# EasyEDA Pro project ProPrj_Practice 4 layer_2025-09-09.epro, schematic Uni Analog In
Board Name: Universal Analog Input; Create Date: 2025-08-09; Page Name: P1; Project Name: Practice 4 layer; Schematic Name: Uni Analog In; Update Date: 2025-08-20; Company: EasyEDA.com; Page Size: A4; Version: V1.0
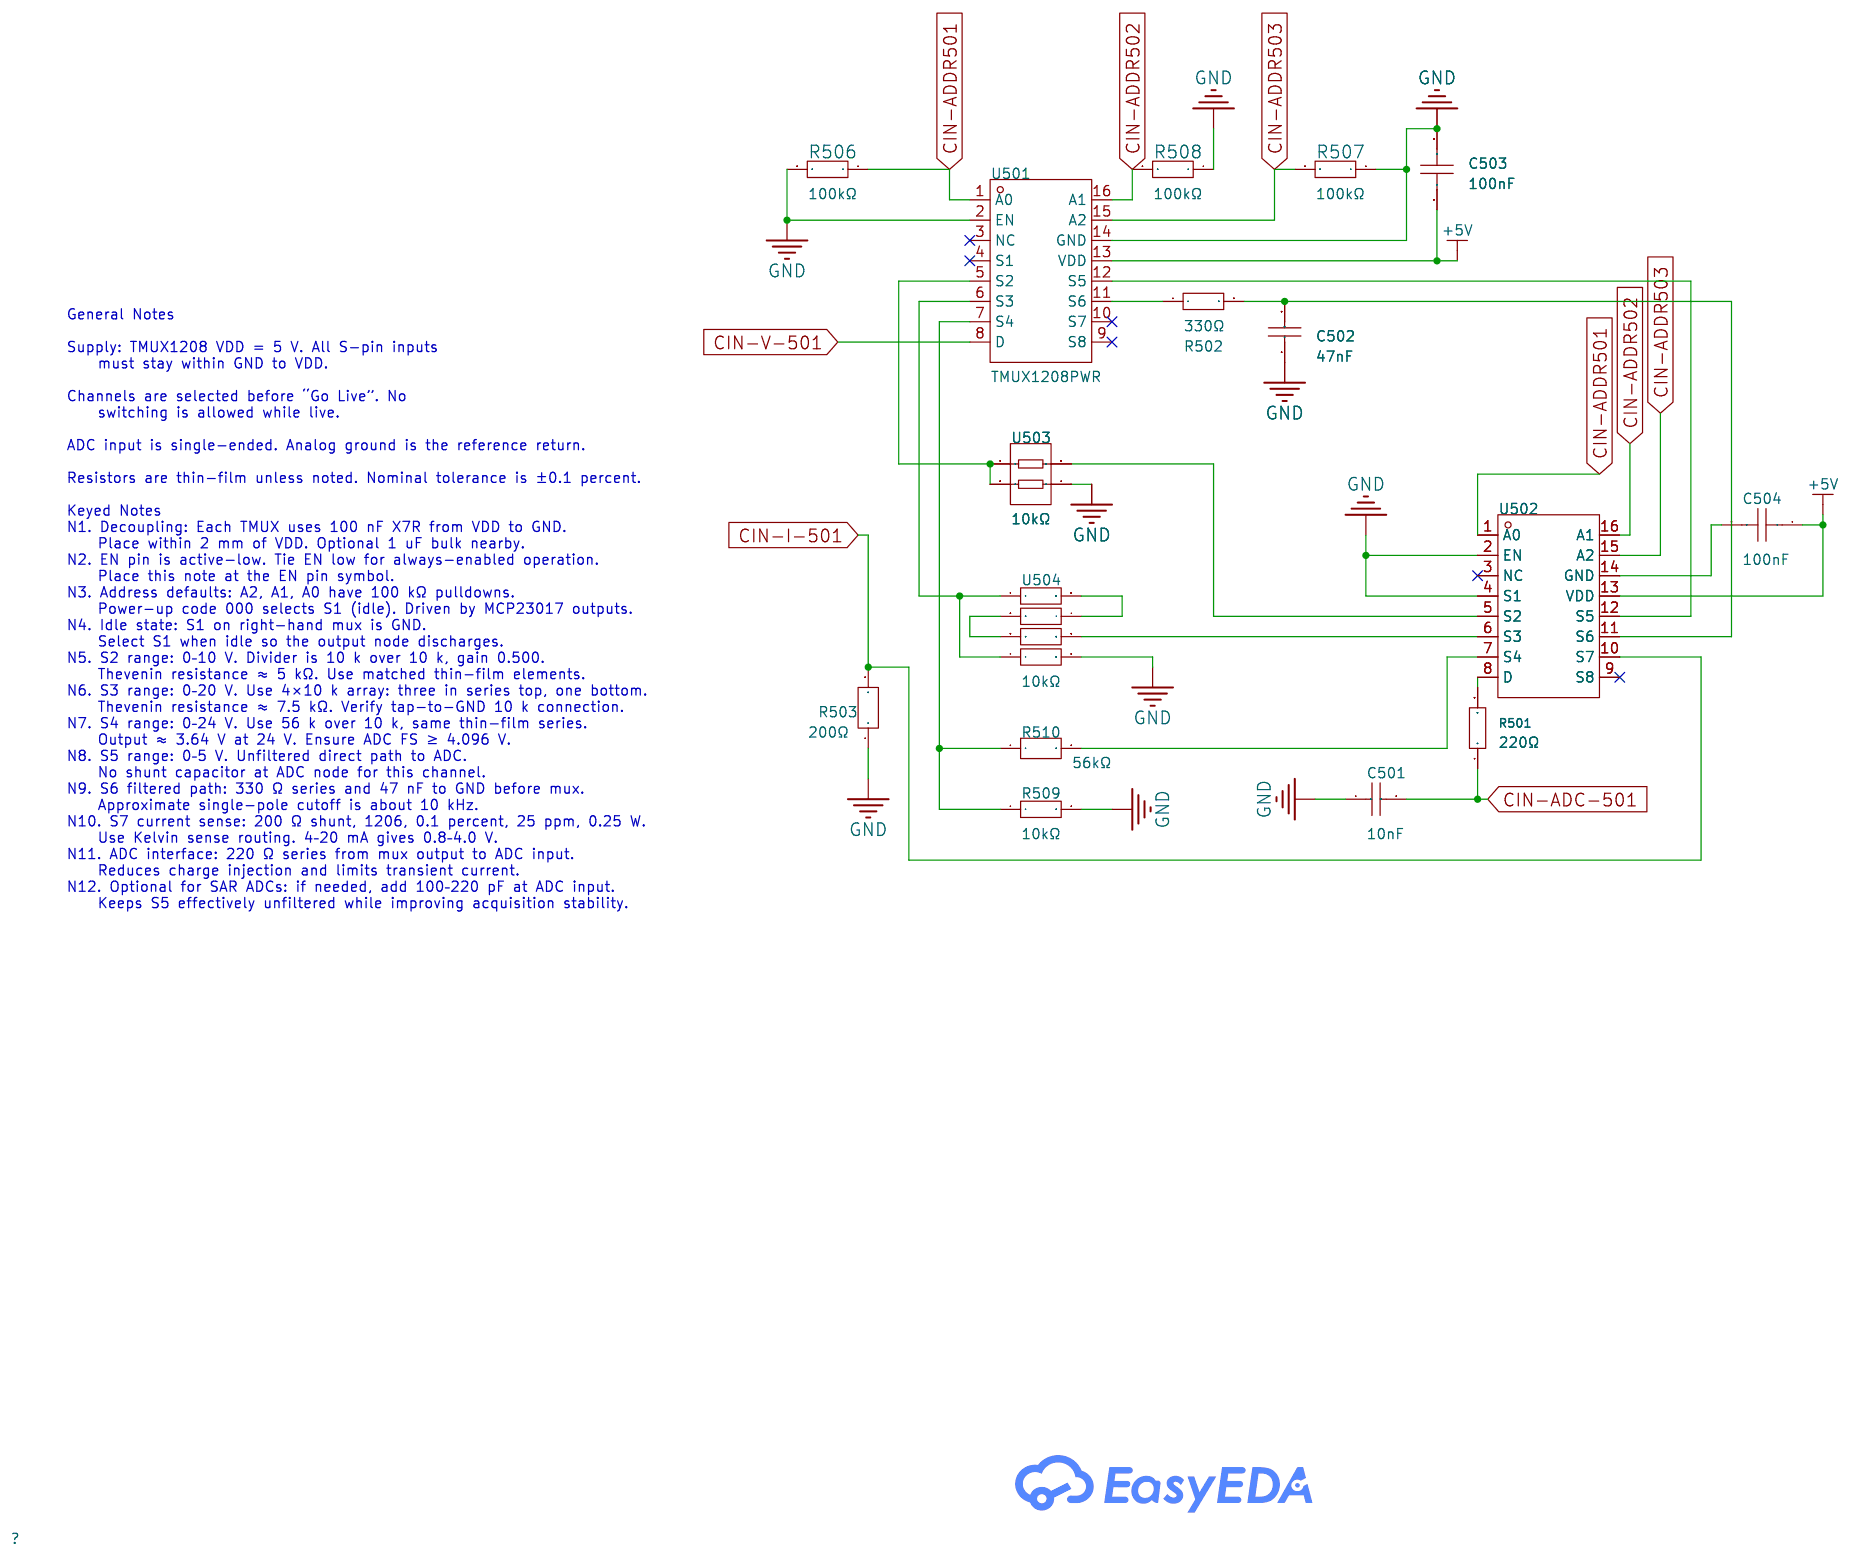
[diagram p7: schematic sheet]

## Parts
C501  10nF  [C0603]
C502  47nF  [C0603]
C503  100nF  [C0603]
C504  100nF  [C0603]
R501  220Ω  [R0603]
R502  330Ω  [R0402]
R503  200Ω  [R1206]
R506  100kΩ  [R0603]
R507  100kΩ  [R0603]
R508  100kΩ  [R0603]
R509  10kΩ  [R0603]
R510  56kΩ  [R0603]
U501  TMUX1208PWR  [TSSOP-16_L5.0-W4.4-P0.65-LS6.4-BL]
U502  TMUX1208PWR  [TSSOP-16_L5.0-W4.4-P0.65-LS6.4-BL]
U503  10kΩ  [RES-ARRAY-SMD_4P-L1.6-W1.5-BL]
U504  10kΩ  [RES-ARRAY-SMD_0603-8P-L3.2-W1.6-BL]

## Library data of the parts
C501 = CL10B103KB8NNNC: Capacitance: Tolerance:±10% Tolerance:±10% Voltage Rated: Temperature Coefficient:; LCSC Part Name: 10nF ±10% 50V; Supplier Part: C1589; Manufacturer: SAMSUNG(三星); Supplier Footprint: 0603; JLCPCB Part Class: Extended Part; Datasheet: https://atta.szlcsc.com/upload/public/pdf/source/20160218/1457707763339.pdf; Supplier: LCSC; Tolerance: ±10%
C502 = CL10B473KB8NNNC: Capacitance: Tolerance:±10% Tolerance:±10% Voltage Rated: Temperature Coefficient:; LCSC Part Name: 47nF ±10% 50V; Supplier Part: C1622; Manufacturer: SAMSUNG(三星); Supplier Footprint: 0603; JLCPCB Part Class: Basic Part; Datasheet: https://atta.szlcsc.com/upload/public/pdf/source/20160218/1457707763339.pdf; Supplier: LCSC; Tolerance: ±10%
C503 C504 = CC0603KRX7R9BB104: Capacitance:100nF Tolerance:±10% Tolerance:±10% Voltage Rating:50V Temperature Coefficient:X7R; LCSC Part Name: 100nF ±10% 50V; Supplier Part: C14663; Manufacturer: YAGEO(国巨); Supplier Footprint: 0603; JLCPCB Part Class: Basic Part; Datasheet: https://atta.szlcsc.com/upload/public/pdf/source/20250214/096C4C206003071F5D32E5F0D8E7F8DF.pdf; Supplier: LCSC; Tolerance: ±10%; Voltage Rating: 50V; Temperature Coefficient: X7R
R501 = 0603WAF2200T5E: Type:Thick Film Resistors Resistance: Tolerance:±1% Tolerance:±1% Power(Watts): Overload Voltage (Max): Temperature Coefficient:±100ppm/℃ Temperature Coefficient:±100ppm/℃ Operating Temperature Range:-55℃~+155℃ Operating Temperature Range:-55℃~+155℃; LCSC Part Name: 220Ω ±1% 100mW 厚膜电阻; Supplier Part: C22962; Manufacturer: UNI-ROYAL(厚声); Supplier Footprint: 0603; JLCPCB Part Class: Basic Part; Datasheet: https://atta.szlcsc.com/upload/public/pdf/source/20200306/C422600_1E6D84923E4A46A82E41ADD87F860B5C.pdf; Supplier: LCSC; Type: Thick Film Resistors; Tolerance: ±1%; Temperature Coefficient: ±100ppm/℃; Operating Temperature Range: -55℃~+155℃
R502 = RC0402FR-07330RL: Type:Thick Film Resistor Resistance:330Ω Tolerance:±1% Tolerance:±1% Power(Watts):62.5mW Voltage-Supply(Max):50V Temperature Coefficient:±100ppm/℃ Temperature Coefficient:±100ppm/℃ Operating Temperature:-55℃~+155℃ Operating Temperature:-55℃~+155℃; LCSC Part Name: 厚膜电阻 330Ω ±1% 62.5mW; Supplier Part: C105875; Manufacturer: YAGEO(国巨); Supplier Footprint: 0402; JLCPCB Part Class: Extended Part; Datasheet: https://item.szlcsc.com/datasheet/RC0402FR-07330RL/107090.html; Supplier: LCSC; Type: Thick Film Resistor; Tolerance: ±1%; Power(Watts): 62.5mW; Voltage-Supply(Max): 50V; Temperature Coefficient: ±100ppm/℃; Operating Temperature: -55℃~+155℃
R503 = RT1206BRD07200RL: Type:Thin Film Resistor Resistance: Tolerance:±0.1% Tolerance:±0.1% Power(Watts):250mW Temperature Coefficient:±25ppm/℃ Temperature Coefficient:±25ppm/℃ Operating Temperature Range:-55℃~+155℃ Operating Temperature Range:-55℃~+155℃; LCSC Part Name: 薄膜电阻 200Ω ±0.1% 250mW; Supplier Part: C870537; Manufacturer: YAGEO(国巨); Supplier Footprint: 1206; JLCPCB Part Class: Extended Part; Datasheet: https://atta.szlcsc.com/upload/public/pdf/source/20200610/C326738_5639A9F1B6EB6E4AE2197577D3456E7F.pdf; Supplier: LCSC; Type: Thin Film Resistor; Tolerance: ±0.1%; Power(Watts): 250mW; Temperature Coefficient: ±25ppm/℃; Operating Temperature Range: -55℃~+155℃
R506-R508 = 0603WAF1002T5E: Type:Thick Film Resistor Resistance:10kΩ Tolerance:±1% Tolerance:±1% Power(Watts):100mW Voltage-Supply(Max):75V Temperature Coefficient:±100ppm/℃ Temperature Coefficient:±100ppm/℃ Operating Temperature:-55℃~+155℃ Operating Temperature:-55℃~+155℃; LCSC Part Name: 厚膜电阻 10kΩ ±1% 100mW; Supplier Part: C25804; Manufacturer: UNI-ROYAL(厚声); Supplier Footprint: 0603; JLCPCB Part Class: Basic Part; Datasheet: https://atta.szlcsc.com/upload/public/pdf/source/20200306/C422600_1E6D84923E4A46A82E41ADD87F860B5C.pdf; Supplier: LCSC; Type: Thick Film Resistor; Tolerance: ±1%; Power(Watts): 100mW; Voltage-Supply(Max): 75V; Temperature Coefficient: ±100ppm/℃; Operating Temperature: -55℃~+155℃
R509 = RT0603BRD0710KL: Type:Thin Film Resistor Resistance:10kΩ Tolerance:±0.1% Tolerance:±0.1% Power(Watts):100mW Voltage-Supply(Max):75V Temperature Coefficient:±25ppm/℃ Temperature Coefficient:±25ppm/℃ Operating Temperature:-55℃~+155℃ Operating Temperature:-55℃~+155℃; LCSC Part Name: 薄膜电阻 10kΩ ±0.1% 100mW; Supplier Part: C95204; Manufacturer: YAGEO(国巨); Supplier Footprint: 0603; JLCPCB Part Class: Extended Part; Datasheet: https://atta.szlcsc.com/upload/public/pdf/source/20250609/0E6D5617EADA80FA3B707391883DF2D5.pdf; Supplier: LCSC; Type: Thin Film Resistor; Tolerance: ±0.1%; Power(Watts): 100mW; Voltage-Supply(Max): 75V; Temperature Coefficient: ±25ppm/℃; Operating Temperature: -55℃~+155℃
R510 = RT0603BRD0756KL: Type:Thin Film Resistor Resistance:56kΩ Tolerance:±0.1% Tolerance:±0.1% Power(Watts):100mW Voltage-Supply(Max):75V Temperature Coefficient:±25ppm/℃ Temperature Coefficient:±25ppm/℃ Operating Temperature:-55℃~+155℃ Operating Temperature:-55℃~+155℃; LCSC Part Name: 薄膜电阻 56kΩ ±0.1% 100mW; Supplier Part: C705785; Manufacturer: YAGEO(国巨); Supplier Footprint: 0603; JLCPCB Part Class: Extended Part; Datasheet: https://item.szlcsc.com/datasheet/RT0603BRD0756KL/742305.html; Supplier: LCSC; Type: Thin Film Resistor; Tolerance: ±0.1%; Power(Watts): 100mW; Voltage-Supply(Max): 75V; Temperature Coefficient: ±25ppm/℃; Operating Temperature: -55℃~+155℃
U501 U502 = TMUX1208PWR: Switch Circuit:SP8T single pole eight throw Number of Channels:8 Supply Voltage:1.08V~5.5V Supply Voltage:1.08V~5.5V Turn-on time:48ns On-State Resistance (Max):9Ω Turn-off time:48ns Operating Temperature:-40℃~+125℃ Operating Temperature:-40℃~+125℃; LCSC Part Name: TMUX1208 5V 双向8:1单通道多路复用器; Supplier Part: C494728; Manufacturer: TI(德州仪器); Supplier Footprint: TSSOP-16; JLCPCB Part Class: Extended Part; Datasheet: https://www.ti.com/cn/lit/gpn/tmux1208; Supplier: LCSC; Switch Circuit: SP8T single pole eight throw; Number of Channels: 8; Supply Voltage: 1.08V~5.5V; Turn-on time: 48ns; On-State Resistance (Max): 9Ω; Turn-off time: 48ns; Operating Temperature: -40℃~+125℃
U503 = ACASN1002S1002P1AT: Number of Resistors: Resistance: Tolerance:±0.1% Tolerance:±0.1% Power(Watts): Temperature Coefficient:±25ppm/℃ Temperature Coefficient:±25ppm/℃ Number of Pins:; LCSC Part Name: 10kΩ ±0.1%; Supplier Part: C2654064; Manufacturer: VISHAY(威世); Supplier Footprint: 0603x2; JLCPCB Part Class: Extended Part; Datasheet: https://atta.szlcsc.com/upload/public/pdf/source/20210610/946032B312301F04FF34E4BF4252574C.pdf; Supplier: LCSC; Tolerance: ±0.1%; Temperature Coefficient: ±25ppm/℃
U504 = ACASA1002S1002P1AT: Number of Resistors: Resistance:10kΩ Tolerance:±0.1% Tolerance:±0.1% Power(Watts):125mW Temperature Coefficient:±25ppm/℃ Temperature Coefficient:±25ppm/℃ Number of Pins:; LCSC Part Name: 10kΩ ±0.1%; Supplier Part: C2654119; Manufacturer: VISHAY(威世); Supplier Footprint: 0603x4; JLCPCB Part Class: Extended Part; Datasheet: https://atta.szlcsc.com/upload/public/pdf/source/20210610/946032B312301F04FF34E4BF4252574C.pdf; Supplier: LCSC; Tolerance: ±0.1%; Power(Watts): 125mW; Temperature Coefficient: ±25ppm/℃

## Nets
+5V: C503.1 C504.1 U501.13(VDD) U502.13(VDD)
GND: C501.1 C502.1 C503.2 R503.1 R506.2 R507.1 R508.1 R509.2 U501.2(EN) U501.14(GND) U502.2(EN) U502.4(S1) U503.4 U504.5
CIN-ADC-501: C501.2 R501.1
CIN-ADDR501: R506.1 U501.1(A0) U502.1(A0)
CIN-ADDR502: R508.2 U501.16(A1) U502.16(A1)
CIN-ADDR503: R507.2 U501.15(A2) U502.15(A2)
CIN-I-501: R503.2 U502.10(S7)
CIN-V-501: U501.8(D)
Net-(C502-2): C502.2 R502.2 U502.11(S6)
Net-(C504-2): C504.2 U502.14(GND)
Net-(R501-2): R501.2 U502.8(D)
Net-(R502-1): R502.1 U501.11(S6)
Net-(R509-1): R509.1 R510.1 U501.7(S4)
Net-(R510-2): R510.2 U502.7(S4)
Net-(U501-5): U501.5(S2) U503.1 U503.3
Net-(U501-6): U501.6(S3) U504.1 U504.4
Net-(U501-12): U501.12(S5) U502.12(S5)
Net-(U502-5): U502.5(S2) U503.2
Net-(U502-6): U502.6(S3) U504.6
Net-(U504-2): U504.2 U504.3
Net-(U504-7): U504.7 U504.8

Not connected (* = marked no-connect by the designer): U501 3(NC)* 4(S1)* 9(S8)* 10(S7)*; U502 3(NC)* 9(S8)*

## Notes on the sheet
- General Notes
  Supply: TMUX1208 VDD = 5 V. All S-pin inputs
      must stay within GND to VDD.
  Channels are selected before “Go Live”. No
      switching is allowed while live.
  ADC input is single-ended. Analog ground is the reference return.
  Resistors are thin-film unless noted. Nominal tolerance is ±0.1 percent.
  Keyed Notes
  N1. Decoupling: Each TMUX uses 100 nF X7R from VDD to GND.
      Place within 2 mm of VDD. Optional 1 uF bulk nearby.
  N2. EN pin is active-low. Tie EN low for always-enabled operation.
      Place this note at the EN pin symbol.
  N3. Address defaults: A2, A1, A0 have 100 kΩ pulldowns.
      Power-up code 000 selects S1 (idle). Driven by MCP23017 outputs.
  N4. Idle state: S1 on right-hand mux is GND.
      Select S1 when idle so the output node discharges.
  N5. S2 range: 0–10 V. Divider is 10 k over 10 k, gain 0.500.
      Thevenin resistance ≈ 5 kΩ. Use matched thin-film elements.
  N6. S3 range: 0–20 V. Use 4×10 k array: three in series top, one bottom.
      Thevenin resistance ≈ 7.5 kΩ. Verify tap-to-GND 10 k connection.
  N7. S4 range: 0–24 V. Use 56 k over 10 k, same thin-film series.
      Output ≈ 3.64 V at 24 V. Ensure ADC FS ≥ 4.096 V.
  N8. S5 range: 0–5 V. Unfiltered direct path to ADC.
      No shunt capacitor at ADC node for this channel.
  N9. S6 filtered path: 330 Ω series and 47 nF to GND before mux.
      Approximate single-pole cutoff is about 10 kHz.
  N10. S7 current sense: 200 Ω shunt, 1206, 0.1 percent, 25 ppm, 0.25 W.
      Use Kelvin sense routing. 4–20 mA gives 0.8–4.0 V.
  N11. ADC interface: 220 Ω series from mux output to ADC input.
      Reduces charge injection and limits transient current.
  N12. Optional for SAR ADCs: if needed, add 100–220 pF at ADC input.
      Keeps S5 effectively unfiltered while improving acquisition stability.
